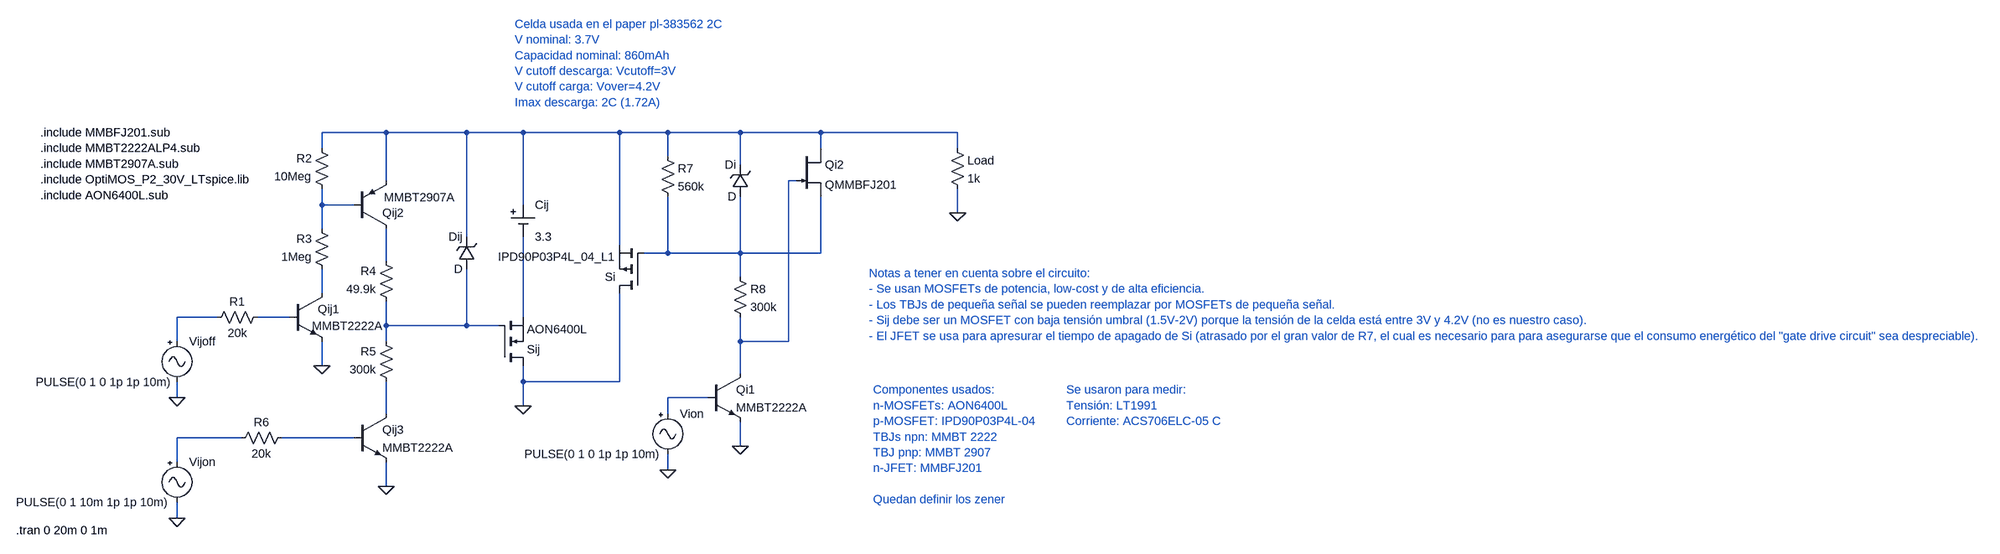
[diagram p0: schematic version1.0.asc]
version1.0.asc, the LTspice schematic file:
Version 4.1
SHEET 1 3348 680
WIRE 16 -576 -112 -576
WIRE 176 -576 16 -576
WIRE 288 -576 176 -576
WIRE 480 -576 288 -576
WIRE 576 -576 480 -576
WIRE 720 -576 576 -576
WIRE 880 -576 720 -576
WIRE 1152 -576 880 -576
WIRE -112 -544 -112 -576
WIRE 880 -544 880 -576
WIRE 1152 -544 1152 -576
WIRE 576 -528 576 -576
WIRE 720 -512 720 -576
WIRE 16 -480 16 -576
WIRE 832 -480 816 -480
WIRE -112 -432 -112 -464
WIRE -48 -432 -112 -432
WIRE 288 -432 288 -576
WIRE 1152 -416 1152 -464
WIRE -112 -384 -112 -432
WIRE 176 -368 176 -576
WIRE 480 -352 480 -576
WIRE 576 -336 576 -448
WIRE 576 -336 528 -336
WIRE 720 -336 720 -448
WIRE 720 -336 576 -336
WIRE 880 -336 880 -448
WIRE 880 -336 720 -336
WIRE 16 -320 16 -384
WIRE 720 -288 720 -336
WIRE -112 -256 -112 -304
WIRE -320 -208 -400 -208
WIRE -176 -208 -240 -208
WIRE 288 -208 288 -368
WIRE 16 -192 16 -240
WIRE 176 -192 176 -304
WIRE 176 -192 16 -192
WIRE 240 -192 176 -192
WIRE -400 -160 -400 -208
WIRE 16 -160 16 -192
WIRE 720 -160 720 -208
WIRE 816 -160 816 -480
WIRE 816 -160 720 -160
WIRE -112 -112 -112 -160
WIRE 720 -96 720 -160
WIRE 288 -80 288 -112
WIRE 480 -80 480 -256
WIRE 480 -80 288 -80
WIRE -400 -48 -400 -80
WIRE 656 -48 576 -48
WIRE 288 -32 288 -80
WIRE 16 -16 16 -80
WIRE 576 -16 576 -48
WIRE -272 32 -400 32
WIRE -48 32 -192 32
WIRE 720 48 720 0
WIRE -400 80 -400 32
WIRE 576 96 576 64
WIRE 16 128 16 80
WIRE -400 192 -400 160
FLAG -400 192 0
FLAG -400 -48 0
FLAG -112 -112 0
FLAG 16 128 0
FLAG 720 48 0
FLAG 576 96 0
FLAG 1152 -416 0
FLAG 288 -32 0
SYMBOL Misc\\cell 288 -432 R0
WINDOW 123 0 0 Left 0
WINDOW 39 0 0 Left 0
SYMATTR InstName Cij
SYMATTR Value 3.3
SYMBOL Misc\\signal -400 -176 R0
WINDOW 3 -281 97 Left 2
WINDOW 123 0 0 Left 0
WINDOW 39 0 0 Left 0
SYMATTR Value PULSE(0 1 0 1p 1p 10m)
SYMATTR InstName Vijoff
SYMBOL Misc\\signal -400 64 R0
WINDOW 3 -320 96 Left 2
WINDOW 123 0 0 Left 0
WINDOW 39 0 0 Left 0
SYMATTR Value PULSE(0 1 10m 1p 1p 10m)
SYMATTR InstName Vijon
SYMBOL npn -176 -256 R0
WINDOW 3 44 65 Left 2
SYMATTR Value MMBT2222A
SYMATTR InstName Qij1
SYMBOL nmos 240 -112 M180
SYMATTR InstName Sij
SYMATTR Value AON6400L
SYMBOL pnp -48 -384 M180
WINDOW 3 60 63 Left 2
SYMATTR Value MMBT2907A
SYMATTR InstName Qij2
SYMBOL njf 832 -544 R0
SYMATTR InstName Qi2
SYMATTR Value QMMBFJ201
SYMBOL npn -48 -16 R0
SYMATTR InstName Qij3
SYMATTR Value MMBT2222A
SYMBOL zener 192 -304 R180
WINDOW 0 24 64 Left 2
WINDOW 3 24 0 Left 2
SYMATTR InstName Dij
SYMBOL zener 736 -448 R180
WINDOW 0 24 64 Left 2
WINDOW 3 24 0 Left 2
SYMATTR InstName Di
SYMBOL res -224 -224 R90
WINDOW 0 0 56 VBottom 2
WINDOW 3 32 56 VTop 2
SYMATTR InstName R1
SYMATTR Value 20k
SYMBOL res -96 -448 R180
WINDOW 0 36 76 Left 2
WINDOW 3 36 40 Left 2
SYMATTR InstName R2
SYMATTR Value 10Meg
SYMBOL res -96 -288 R180
WINDOW 0 36 76 Left 2
WINDOW 3 36 40 Left 2
SYMATTR InstName R3
SYMATTR Value 1Meg
SYMBOL res 32 -224 R180
WINDOW 0 36 76 Left 2
WINDOW 3 36 40 Left 2
SYMATTR InstName R4
SYMATTR Value 49.9k
SYMBOL res 32 -64 R180
WINDOW 0 36 76 Left 2
WINDOW 3 36 40 Left 2
SYMATTR InstName R5
SYMATTR Value 300k
SYMBOL res -288 48 R270
WINDOW 0 32 56 VTop 2
WINDOW 3 0 56 VBottom 2
SYMATTR InstName R6
SYMATTR Value 20k
SYMBOL res 560 -544 R0
SYMATTR InstName R7
SYMATTR Value 560k
SYMBOL res 704 -304 R0
SYMATTR InstName R8
SYMATTR Value 300k
SYMBOL npn 656 -96 R0
SYMATTR InstName Qi1
SYMATTR Value MMBT2222A
SYMBOL Misc\\signal 576 -32 R0
WINDOW 3 -285 96 Left 2
WINDOW 123 0 0 Left 0
WINDOW 39 0 0 Left 0
SYMATTR Value PULSE(0 1 0 1p 1p 10m)
SYMATTR InstName Vion
SYMBOL res 1136 -560 R0
SYMATTR InstName Load
SYMATTR Value 1k
SYMBOL pmos 528 -256 R180
SYMATTR InstName Si
SYMATTR Value IPD90P03P4L_04_L1
SYMATTR Prefix X
TEXT 976 -296 Left 2 ;Notas a tener en cuenta sobre el circuito:\n- Se usan MOSFETs de potencia, low-cost y de alta eficiencia.\n- Los TBJs de pequeña señal se pueden reemplazar por MOSFETs de pequeña señal.\n- Sij debe ser un MOSFET con baja tensión umbral (1.5V-2V) porque la tensión de la celda está entre 3V y 4.2V (no es nuestro caso).\n- El JFET se usa para apresurar el tiempo de apagado de Si (atrasado por el gran valor de R7, el cual es necesario para para asegurarse que el consumo energético del "gate drive circuit" sea despreciable).
TEXT 272 -792 Left 2 ;Celda usada en el paper pl-383562 2C\nV nominal: 3.7V\nCapacidad nominal: 860mAh\nV cutoff descarga: Vcutoff=3V\nV cutoff carga: Vover=4.2V\nImax descarga: 2C (1.72A)
TEXT 984 -64 Left 2 ;Componentes usados:\nn-MOSFETs: AON6400L\np-MOSFET: IPD90P03P4L-04\nTBJs npn: MMBT 2222\nTBJ pnp: MMBT 2907\nn-JFET: MMBFJ201\n \nQuedan definir los zener
TEXT 1368 -64 Left 2 ;Se usaron para medir:\nTensión: LT1991\nCorriente: ACS706ELC-05 C
TEXT -672 -576 Left 2 !.include MMBFJ201.sub\n.include MMBT2222ALP4.sub\n.include MMBT2907A.sub\n.include OptiMOS_P2_30V_LTspice.lib\n.include AON6400L.sub
TEXT -720 216 Left 2 !.tran 0 20m 0 1m

The netlist it stands for:
* version1.0.asc
V§Cij N001 N009 3.3
Vijoff N007 0 PULSE(0 1 0 1p 1p 10m)
Vijon N013 0 PULSE(0 1 10m 1p 1p 10m)
Qij1 N006 N008 0 0 MMBT2222A
M§Sij 0 N010 N009 N009 AON6400L
Qij2 N005 N003 N001 0 MMBT2907A
J§Qi2 N001 N002 N004 QMMBFJ201
Qij3 N012 N014 0 0 MMBT2222A
Dij N010 N001 D
Di N004 N001 D
R1 N008 N007 20k
R2 N003 N001 10Meg
R3 N006 N003 1Meg
R4 N010 N005 49.9k
R5 N012 N010 300k
R6 N013 N014 20k
R7 N001 N004 560k
R8 N004 N002 300k
Qi1 N002 N011 0 0 MMBT2222A
Vion N011 0 PULSE(0 1 0 1p 1p 10m)
R§Load N001 0 1k
X§Si 0 N004 N001 IPD90P03P4L_04_L1  ; pins D G S
.model D D
.lib standard.dio
.model NPN NPN
.model PNP PNP
.lib standard.bjt
.model NJF NJF
.model PJF PJF
.lib standard.jft
.model NMOS NMOS
.model PMOS PMOS
.lib standard.mos
* Notas a tener en cuenta sobre el circuito:
* - Se usan MOSFETs de potencia, low-cost y de alta eficiencia.
* - Los TBJs de pequeña señal se pueden reemplazar por MOSFETs de pequeña señal.
* - Sij debe ser un MOSFET con baja tensión umbral (1.5V-2V) porque la tensión de la celda está entre 3V y 4.2V (no es nuestro caso).
* - El JFET se usa para apresurar el tiempo de apagado de Si (atrasado por el gran valor de R7, el cual es necesario para para asegurarse que el consumo energético del "gate drive circuit" sea despreciable).
* Celda usada en el paper pl-383562 2C
* V nominal: 3.7V
* Capacidad nominal: 860mAh
* V cutoff descarga: Vcutoff=3V
* V cutoff carga: Vover=4.2V
* Imax descarga: 2C (1.72A)
* Componentes usados:
* n-MOSFETs: AON6400L
* p-MOSFET: IPD90P03P4L-04
* TBJs npn: MMBT 2222
* TBJ pnp: MMBT 2907
* n-JFET: MMBFJ201
* Quedan definir los zener
* Se usaron para medir:
* Tensión: LT1991
* Corriente: ACS706ELC-05 C
.include MMBFJ201.sub
.include MMBT2222ALP4.sub
.include MMBT2907A.sub
.include OptiMOS_P2_30V_LTspice.lib
.include AON6400L.sub
.tran 0 20m 0 1m
.backanno
.end